# EAGLE schematic v1.0_r1 (EAGLE 9.6.2)
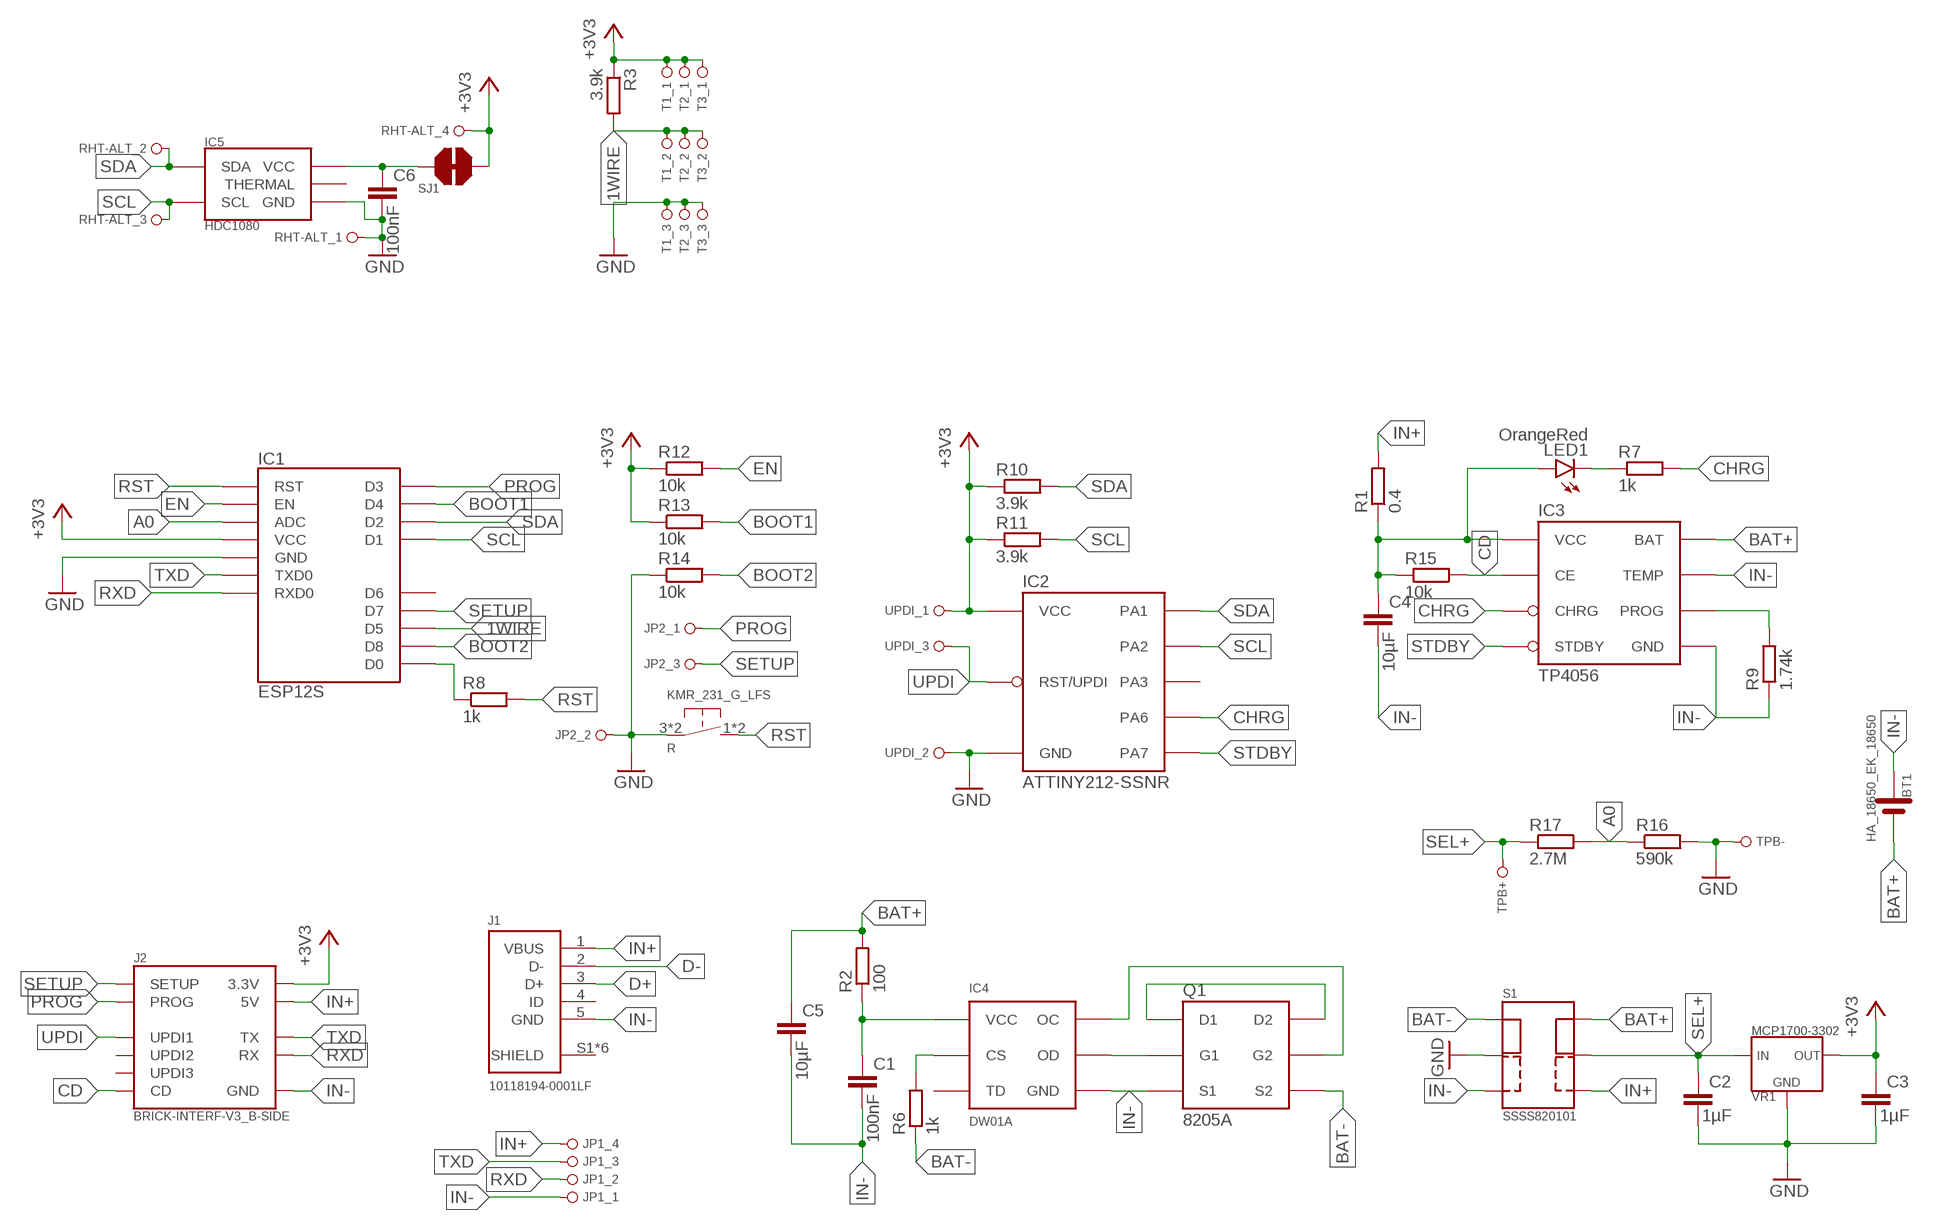
[diagram p0: schematic, sheet 1]

## Parts
BT1  HA_18650_EK_18650  [HA_18650_EK_18650]
C1  100nF  C-EUC0805  [C0805]
C2  1µF  C-EUC0805  [C0805]
C3  1µF  C-EUC0805  [C0805]
C4  10µF  C-EUC0805  [C0805]
C5  10µF  C-EUC0805  [C0805]
C6  100nF  C-EUC0805  [C0805]
IC1  ESP12S  [ESP12S]
IC2  ATTINY212-SSNR  [SOIC8]
IC3  TP4056  [SO8-THERMALPAD]
IC4  DW01A  [SOT23-6]
IC5  HDC1080  [HDC1080]
J1  10118194-0001LF  [10118194-0001LF]
J2  BRICK-INTERF-V3_B-SIDE  [DF9-11P-1V(32)]
JP1  PINHD_1X04_R_1  [1X04_R_1]
JP2  PINHD_1X03_R_1  [1X03_R_1]
LED1  OrangeRed  LEDCHIP-LED0805  [CHIP-LED0805]
Q1  8205A  [TSSOP8]
R  KMR_231_G_LFS  [KMR_231_G_LFS]
R1  0.4  R-EU_R0805  [R0805]
R2  100  R-EU_R0805  [R0805]
R3  3.9k  R-EU_R0805  [R0805]
R6  1k  R-EU_R0805  [R0805]
R7  1k  R-EU_R0805  [R0805]
R8  1k  R-EU_R0805  [R0805]
R9  1.74k  R-EU_R0805  [R0805]
R10  3.9k  R-EU_R0805  [R0805]
R11  3.9k  R-EU_R0805  [R0805]
R12  10k  R-EU_R0805  [R0805]
R13  10k  R-EU_R0805  [R0805]
R14  10k  R-EU_R0805  [R0805]
R15  10k  R-EU_R0805  [R0805]
R16  590k  R-EU_R0805  [R0805]
R17  2.7M  R-EU_R0805  [R0805]
RHT-ALT  PINHD_1X04_R_1  [1X04_R_1]
S1  SSSS820101  [SSSS820101]
SJ1  SOLDERBRIDGE  [SOLDERBRIDGE]
T1  PINHD_1X03_R_1  [1X03_R_1]
T2  PINHD_1X03_R_1  [1X03_R_1]
T3  PINHD_1X03_R_1  [1X03_R_1]
TPB+  PINHD_1X01_S_0.8  [1X01_S_0.8]
TPB-  PINHD_1X01_S_0.8  [1X01_S_0.8]
UPDI  PINHD_1X03_R_1  [1X03_R_1]
VR1  MCP1700-3302  [SOT23]

## Nets
1WIRE: IC1.GPIO14(D5) R3.2 T1.2 T2.2 T3.2
+3V3: C3.1 IC1.VCC IC2.1(VCC) J2.10(3.3V) R3.1 R10.1 R11.1 R12.1 R13.1 RHT-ALT.4 SJ1.2 T1.1 T2.1 T3.1 UPDI.1 VR1.2(OUT)
A0: IC1.ADC R16.1 R17.2
BAT+: BT1.P1(PLUS) BT1.P2(PLUS) BT1.P3(PLUS) C5.1 IC3.5(BAT) R2.2 S1.6
BAT-: Q1.6(S2) Q1.7(S2) R6.1 S1.3
BOOT1: IC1.GPIO2(D4) R13.2
BOOT2: IC1.GPIO15(D8) R14.2
CD: IC3.8(CE) J2.5(CD) R15.2
CHRG: IC2.2(PA6) IC3.7(CHRG) R7.2
D+: J1.3(D+)
D-: J1.2(D-)
EN: IC1.EN R12.2
GND: C2.2 C3.2 C6.2 IC1.GND IC2.8(GND) IC5.2(GND) JP2.2 R14.1 R16.2 R.3 R.4 RHT-ALT.1 S1.2 T1.3 T2.3 T3.3 TPB-.1 UPDI.2 VR1.1(GND)
IN+: J1.1(VBUS) J2.4(5V) JP1.4 R1.2 S1.4
IN-: BT1.M1(MINUS) BT1.M2(MINUS) BT1.M3(MINUS) C1.2 C4.2 C5.2 IC3.1(TEMP) IC3.3(GND) IC3.T1(GND) IC3.T2(GND) IC3.T3(GND) IC3.T4(GND) IC3.T5(GND) IC3.T6(GND) IC3.T7(GND) IC3.T8(GND) IC4.6(GND) J1.5(GND) J2.6(GND) JP1.1 Q1.2(S1) Q1.3(S1) R9.1 S1.1
N$1: C4.1 IC3.4(VCC) LED1.A R1.1 R15.1
N$2: IC3.2(PROG) R9.2
N$3: IC4.2(CS) R6.2
N$4: C1.1 IC4.5(VCC) R2.1
N$5: C6.1 IC5.5(VCC) SJ1.1
N$7: LED1.C R7.1
N$8: IC4.1(OD) Q1.4(G1)
N$10: Q1.1(D1) Q1.8(D2)
N$11: IC4.3(OC) Q1.5(G2)
PROG: IC1.GPIO0(D3) J2.3(PROG) JP2.1
RST: IC1.RST R8.2 R.1 R.2
RXD: IC1.RXD0 J2.11(RX) JP1.2
SCL: IC1.GPIO5(D1) IC2.5(PA2) IC5.6(SCL) R11.2 RHT-ALT.3
SDA: IC1.GPIO4(D2) IC2.4(PA1) IC5.1(SDA) R10.2 RHT-ALT.2
SEL+: C2.1 R17.1 S1.5 TPB+.1 VR1.3(IN)
SETUP: IC1.GPIO13(D7) J2.2(SETUP) JP2.3
STDBY: IC2.3(PA7) IC3.6(STDBY)
TXD: IC1.TXD0 J2.1(TX) JP1.3
UPDI: IC2.6(RST/UPDI) J2.7(UPDI1) UPDI.3
WAKE: IC1.GPIO16(D0) R8.1
Unconnected: IC1.GPIO12(D6) IC2.7(PA3) IC4.4(TD) IC5.7(THERMAL) IC5.7.1(THERMAL) IC5.7.2(THERMAL) IC5.7.3(THERMAL) IC5.7.4(THERMAL) J1.4(ID) J2.8(UPDI2) J2.9(UPDI3)

## Power pins joined to a net without a drawn wire
SHIELD: J1.S1(SHIELD) J1.S2(SHIELD) J1.S3(SHIELD) J1.S4(SHIELD) J1.S5(SHIELD) J1.S6(SHIELD)

## Library data of the parts
BT1 = no_reichelt:HA_18650_EK
C1-C6 = rcl:C-EU: CAPACITOR, European symbol; SPICEPREFIX: C
IC1 = no_expressif:ESP12S
IC2 = no_microchip:ATTINY212
IC3 = no_reichelt:TP4056
IC4 = no_reichelt:DW01A
IC5 = no_reichelt:HDC1080
J1 = no_reichelt:10118194-0001LF: CONN RCPT USB2.0 MICRO B SMD R/A Manufacturer's datasheet <https://www.amphenol-icc.com/media/wysiwyg/files/drawing/10118194.pdf?__cf_chl_jschl_tk__=1e9b4569481076e99900b246ea640525553a7b60-1588047333-0-AZhEk6D50lwOf6CdaXmV1teudqMKHMxqtb1pEtnUtu77sOc-OVRjbCmHdORomVnr0W49D2E8XkcMdJ2SdWt5rDDYIblyJz7fSv-zilM8vQKAQDC1Z9aMVORhnMgYjPDuz8XpfDLul_eaqqFpemo1xIgoZv50WTuLMwu26ci7e02s9PWvR3z1cDqm9GMGYIPwIUd9yh5-TtN_o6DbEkadC7zoJlhYZSw-VEaYzfWnBSFg_n44fbEB3slHLR2YKLSiTmh8RSwpxKUP4gER0KeVoie9w-Ibtx3oKQbsZjrsPLGSu9BzV2nf3QeoErALCQuycvY9WhQdebLIpxaon6SXufpVIIdoKZHRpjuVVlAkUIr9oSIZGQzzOWY1-dWY48jVEOvnvoxw9-xup5uFcr7XWo0>; CREATED_BY: PCBLayout.com; DIGIKEY_PARTNO: 609-4618-2-ND; MANUFACTURER: Amphenol ICC (FCI); MPN: 10118194-0001LF
J2 = no_brick_interface:BRICK-INTERF-V3
JP1 RHT-ALT = no_pinhd:PINHD_1X04; DRILL: 1mm; PADSHAPE: round
JP2 T1-T3 UPDI = no_pinhd:PINHD_1X03; DRILL: 1mm; PADSHAPE: round
LED1 = led:LED: LED OSRAM: - CHIPLED LG R971, LG N971, LY N971, LG Q971, LY Q971, LO R971, LY R971 LH N974, LH R974 LS Q976, LO Q976, LY Q976 LO Q996 - Hyper CHIPLED LW Q18S LB Q993, LB Q99A, LB R99A - SideLED LS A670, LO A670, LY A670, LG A670, LP A670 LB A673, LV A673, LT A673, LW A673 LH A674 LY A675 LS A676, LA A676, LO A676, LY A676, LW A676 LS A679, LY A679, LG A679 - Hyper Micro SIDELED® LS Y876, LA Y876, LO Y876, LY Y876 LT Y87S - SmartLED LW L88C, LW L88S LB L89C, LB L89S, LG L890 LS L89K, LO L89K, LY L89K LS L896, LA L896, LO L896, LY L896 - TOPLED LS T670, LO T670, LY T670, LG T670, LP T670 LSG T670, LSP T670, LSY T670, LOP T670, LYG T670 LG T671, LOG T671, LSG T671 LB T673, LV T673, LT T673, LW T673 LH T674 LS T676, LA T676, LO T676, LY T676, LB T676, LH T676, LSB T676, LW T676 LB T67C, LV T67C, LT T67C, LS T67K, LO T67K, LY T67K, LW E67C LS E67B, LA E67B, LO E67B, LY E67B, LB E67C, LV E67C, LT E67C LW T67C LS T679, LY T679, LG T679 LS T770, LO T770, LY T770, LG T770, LP T770 LB T773, LV T773, LT T773, LW T773 LH T774 LS E675, LA E675, LY E675, LS T675 LS T776, LA T776, LO T776, LY T776, LB T776 LHGB T686 LT T68C, LB T68C - Hyper Mini TOPLED® LB M676 - Mini TOPLED Santana® LG M470 LS M47K, LO M47K, LY M47K Source: http://www.osram.convergy.de LUXEON: - LUMILED® LXK2-PW12-R00, LXK2-PW12-S00, LXK2-PW14-U00, LXK2-PW14-V00 LXK2-PM12-R00, LXK2-PM12-S00, LXK2-PM14-U00 LXK2-PE12-Q00, LXK2-PE12-R00, LXK2-PE12-S00, LXK2-PE14-T00, LXK2-PE14-U00 LXK2-PB12-K00, LXK2-PB12-L00, LXK2-PB12-M00, LXK2-PB14-N00, LXK2-PB14-P00, LXK2-PB14-Q00 LXK2-PR12-L00, LXK2-PR12-M00, LXK2-PR14-Q00, LXK2-PR14-R00 LXK2-PD12-Q00, LXK2-PD12-R00, LXK2-PD12-S00 LXK2-PH12-R00, LXK2-PH12-S00 LXK2-PL12-P00, LXK2-PL12-Q00, LXK2-PL12-R00 Source: www.luxeon.com KINGBRIGHT: KA-3528ASYC Source: www.kingbright.com
Q1 = no_reichelt:8205A
R = no_reichelt:KMR_231_G_LFS
R1-R3 R6-R17 = rcl:R-EU_: RESISTOR, European symbol; SPICEPREFIX: R
S1 = no_reichelt:SSSS820101
SJ1 = no_pinhd:SOLDERBRIDGE
TPB+ TPB- = no_pinhd:PINHD_1X01; DRILL: 0.8mm; PADSHAPE: square
VR1 = no_reichelt:MCP170